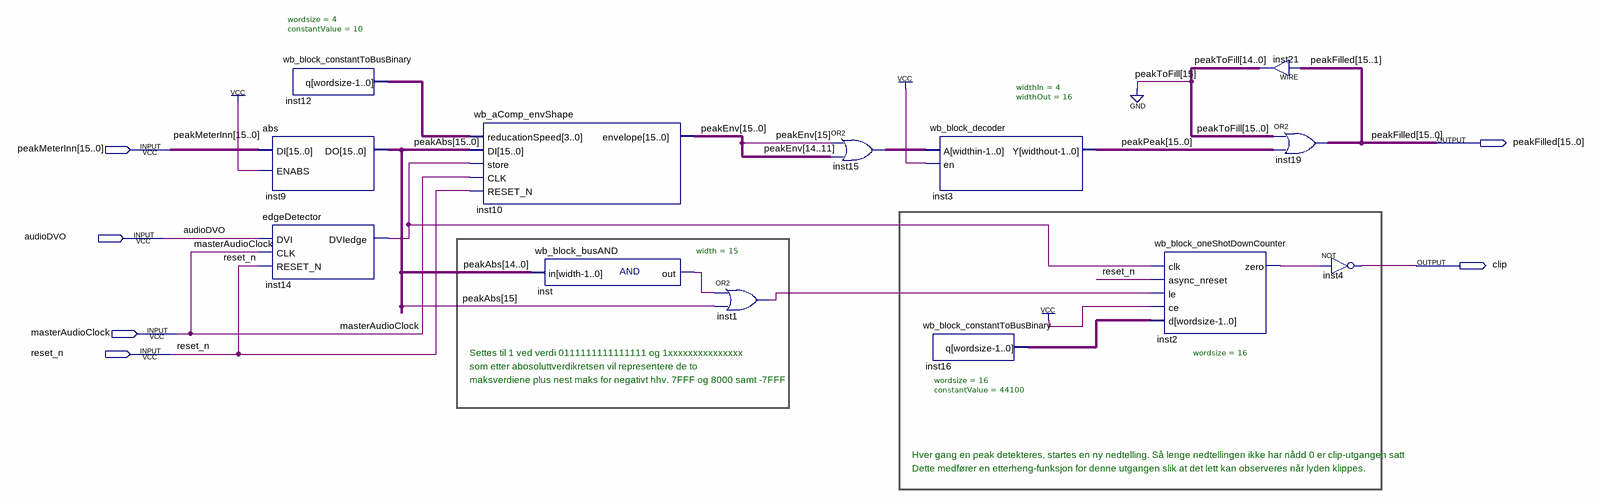
[diagram p0: schematic sheet]
// Quartus schematic wb_audio_peakmeter.bdf as structural Verilog: 13 symbols, 6 pins
module wb_audio_peakmeter (
  input  [15:0] peakMeterInn,
  input  audioDVO,
  input  masterAudioClock,
  input  reset_n,
  output [15:0] peakFilled,
  output clip
);

  wire inst1_out, inst2_zero, inst14_dviedge, inst_out;
  wire [3:0] inst12_q, inst15_out;
  wire [14:0] peakToFill;
  wire [15:0] inst16_q, peakAbs, peakEnv, peakPeak;

  wb_block_constantToBusBinary #(.wordsize(4), .constantValue(10)) inst12 (.q(inst12_q));
  abs inst9 (.ENABS(1'b1), .DI(peakMeterInn), .DO(peakAbs));
  edgeDetector inst14 (.DVI(audioDVO), .CLK(masterAudioClock), .RESET_N(reset_n), .DVIedge(inst14_dviedge));
  wb_aComp_envShape inst10 (
    .reducationSpeed(inst12_q), .DI(peakAbs), .CLK(masterAudioClock), .store(inst14_dviedge),
    .RESET_N(reset_n), .envelope(peakEnv));
  wb_block_busAND #(.width(15)) inst (.in(peakAbs[14:0]), .out(inst_out));
  or inst1 (inst1_out, inst_out, peakAbs[15]);
  assign inst15_out = {4{peakEnv[15]}} | peakEnv[14:11];  // OR2 inst15, 4 bits wide
  wb_block_decoder #(.widthIn(4), .widthOut(16)) inst3 (.A(inst15_out), .en(1'b1), .Y(peakPeak));
  wb_block_constantToBusBinary #(.wordsize(16), .constantValue(44100)) inst16 (.q(inst16_q));
  wb_block_oneShotDownCounter #(.wordsize(16)) inst2 (
    .clk(inst14_dviedge), .async_nreset(reset_n), .le(inst1_out), .ce(1'b1), .d(inst16_q), .zero(inst2_zero));
  assign peakToFill = peakFilled[15:1];  // WIRE inst21
  assign peakFilled = {1'b0, peakToFill} | peakPeak;  // OR2 inst19, 16 bits wide
  not inst4 (clip, inst2_zero);

  // Notes on the sheet:
  //   Settes til 1 ved verdi 0111111111111111 og 1xxxxxxxxxxxxxxx
  //   som etter abosoluttverdikretsen vil representere de to
  //   maksverdiene plus nest maks for negativt hhv. 7FFF og 8000 samt -7FFF
  //   Hver gang en peak detekteres, startes en ny nedtelling. Så lenge nedtellingen ikke har nådd 0 er clip-utgangen satt
  //   Dette medfører en etterheng-funksjon for denne utgangen slik at det lett kan observeres når lyden klippes.
endmodule
